# EasyEDA Pro project ProPrj_Dual_Motor_Driver_2026-05-02.epro, board PCB1
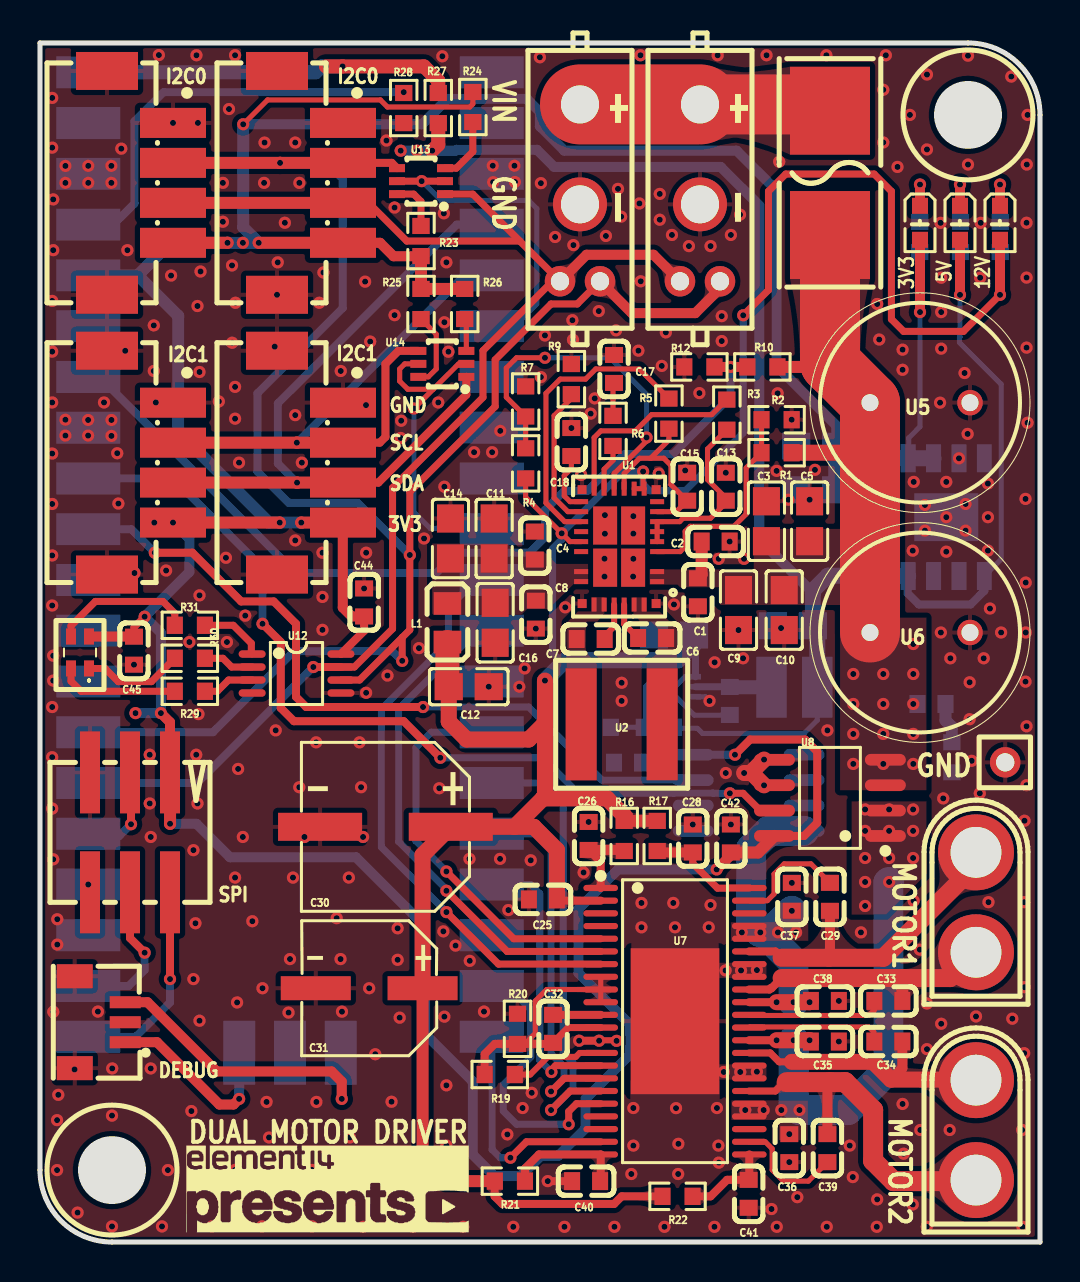
[diagram p3: board, top side]
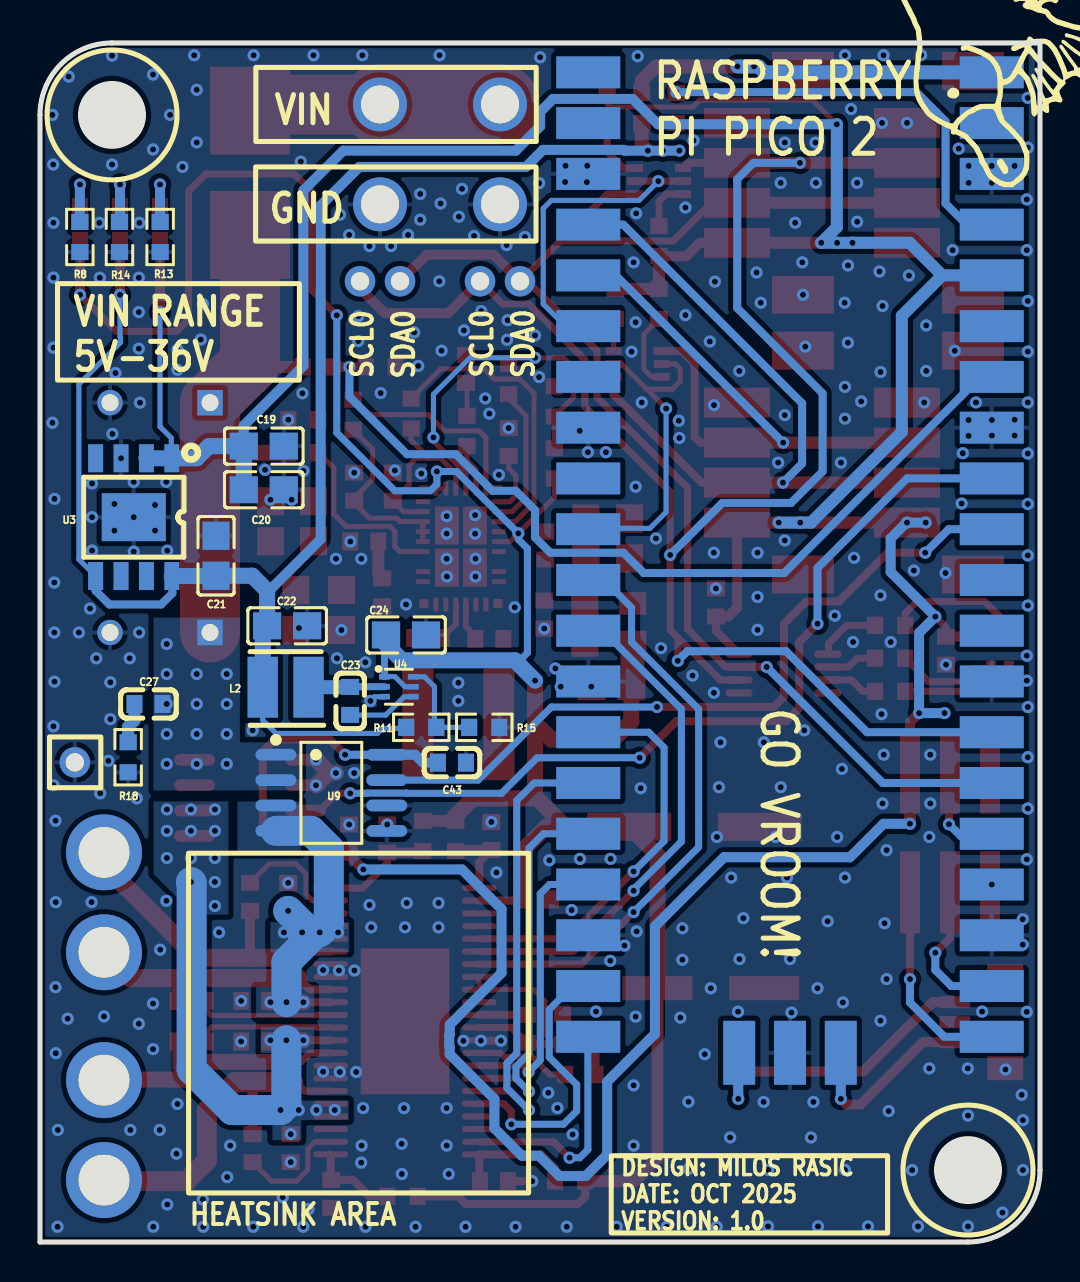
[diagram p4: board, bottom side, seen from below]

Outline 50 x 60 mm; copper layers: Top Layer, Inner1, Inner2, Bottom Layer. Coordinates in mm from the lower left corner of the outline.
Outline path: 0,60 46.4,60 arc(48.95,58.94) 50,56.4 50,0 3.6,0 arc(1.05,1.05) 0,3.6 0,60
Stack: Top Layer 0.035mm Outer layer thickness 1oz / Dielectric1 0.2104mm 7628 RC49% 8.6mil / Inner1 0.0152mm Inner layer thickness / Dielectric2 1.065mm 1.1mm H/HOZ Copper / Inner2 0.0152mm Inner layer thickness / Dielectric3 0.2104mm 7628 RC49% 8.6mil / Bottom Layer 0.035mm Outer layer thickness 1oz

## Design rules (mm)
template: Custom Config
spacing copperThickness1oz (default): track to track 0.102, other pairs 0.152 to 0.3
spacing copperThickness2oz: track to track 0.203, other pairs 0.152 to 0.3
track width copperThickness1oz (default): min 0.127, default 0.254, max 5
track width copperThickness2oz: min 0.203, default 0.254, max 5
differential pair differentialPair (default): width min 0.127, default 0.254, max 2.54; gap min 0.152, default 0.152
via viaSize (default): diameter min 0.5, default 0.61, max 10; hole min 0.3, default 0.305, max 6.3

## Placement (name value [footprint] x y rotation side)
1PinHeader  -  [1PinHeader]  48.26 24 0 top
C1  100nF  [C0603]  32.89 32.51 270 top
C2  100nF  [C0603]  33.78 35.05 0 top
C3  10uF  [C0805]  36.32 36.07 90 top
C4  100nF  [C0603]  24.74 34.85 90 top
C5  10uF  [C0805]  38.48 36.07 270 top
C6  100nF  [C0603]  30.61 30.23 0 top
C7  100nF  [C0603]  27.53 30.17 180 top
C8  100nF  [C0603]  24.79 31.39 270 top
C9  10uF  [C0805]  34.93 31.62 90 top
C10  10uF  [C0805]  37.21 31.62 90 top
C11  22uF  [C0805]  22.71 35.2 90 top
C12  22uF  [C0805]  21.44 27.79 0 top
C13  4.7uF  [C0603]  34.29 37.8 90 top
C14  22uF  [C0805]  20.52 35.2 90 top
C15  470nF  [C0603]  32.36 37.8 90 top
C16  22uF  [C0805]  22.76 30.99 270 top
C17  22nF  [C0603]  28.7 43.69 90 top
C18  100nF  [C0603]  26.57 40.03 270 top
C19  22uF  [C0805]  38.81 39.83 0 bottom
C20  22uF  [C0805]  38.81 37.64 0 bottom
C21  22uF  [C0805]  41.2 34.34 270 bottom
C22  22uF  [C0805]  37.64 30.84 0 bottom
C23  100nF  [C0603]  34.49 27.08 270 bottom
C24  22uF  [C0805]  31.7 30.38 0 bottom
C25  1uF  [C0603]  25.15 17.14 0 top
C26  1uF  [C0603]  27.43 20.32 270 top
C27  10nF  [C0603]  44.58 26.92 0 bottom
C28  1uF  [C0603]  32.64 20.19 270 top
C29  1uF  [C0603]  39.5 17.27 270 top
C30  330uF  [CAP-SMD_BD8.0-L8.3-W8.3-FD]  17.27 20.78 180 top
C31  47uF  [CAP-SMD_BD6.3-L6.6-W6.6-LS7.8-FD]  16.46 12.7 180 top
C32  100nF  [C0603]  25.65 10.67 90 top
C33  1uF  [C0603]  42.42 12.06 0 top
C34  1uF  [C0603]  42.42 10.03 0 top
C35  100nF  [C0603]  39.24 10.03 180 top
C36  100nF  [C0603]  37.47 4.7 90 top
C37  100nF  [C0603]  37.59 17.27 270 top
C38  100nF  [C0603]  39.24 12.06 180 top
C39  1uF  [C0603]  39.37 4.7 90 top
C40  1uF  [C0603]  27.31 3.05 180 top
C41  1uF  [C0603]  35.43 2.41 270 top
C42  100nF  [C0603]  34.54 20.19 90 top
C43  100nF  [C0603]  29.4 23.99 180 bottom
C44  100nF  [C0603]  16.21 32 270 top
C45  100nF  [C0603]  4.7 29.59 90 top
CN1  XT30U-M  [CONN-TH_XT30U-M]  46.8 17 90 top
CN2  XT30U-M  [CONN-TH_XT30U-M]  46.8 5.6 90 top
CN3  WAFER-PH2.0-4PLB  [CONN-SMD_4P-P2.00_WAFER-200L-4A]  13.5 53 270 top
CN4  WAFER-PH2.0-4PLB  [CONN-SMD_4P-P2.00_WAFER-200L-4A]  5 53 270 top
CN5  WAFER-PH2.0-4PLB  [CONN-SMD_4P-P2.00_WAFER-200L-4A]  5 39 270 top
CN6  WAFER-PH2.0-4PLB  [CONN-SMD_4P-P2.00_WAFER-200L-4A]  13.5 39 270 top
CN7  98424-G52-06ALF  [CONN-SMD_98424-G52-06ALF]  4.5 20.5 180 top
F1  0154001.DR  [FUSE-SMD_L9.8-W5.1]  39.5 53.5 270 top
L1  MPZ2012S221ATD25  [L0805]  20.37 30.99 270 top
L2  ME3220-472MLC  [IND-SMD_L3.2-W2.8]  37.72 27.76 180 bottom
LED1  -  [LED0603-R-RD]  48 51 270 top
LED2  -  [LED0603-R-RD]  44 51 270 top
LED3  -  [LED0603-R-RD]  46 51 270 top
LED4  -  [150066M153000]  2 29.5 90 top
MH1  M3 Screw  [MOUNTINGHOLE-M3]  46.4 56.4 0 top
MH2  M3 Screw  [MOUNTINGHOLE-M3]  3.6 3.6 0 top
PowerConnector1  XT30(2+2)PB-M.G.B  [CONN-TH_XT30PB-M]  27 52.5 270 top
PowerConnector2  XT30(2+2)PB-M.G.B  [CONN-TH_XT30PB-M]  33 52.5 270 top
R1  120k  [R0603]  36.83 39.5 0 top
R2  100k  [R0603]  36.83 41.15 180 top
R3  100k  [R0603]  34.34 41.4 270 top
R4  110k  [R0603]  24.28 38.96 270 top
R5  100k  [R0603]  31.44 41.45 90 top
R6  5.1k  [R0603]  28.65 40.59 270 top
R7  10K  [R0603]  24.28 42.06 270 top
R8  4.7k  [R0603]  48.01 50.29 90 bottom
R9  143k  [R0603]  26.57 43.18 270 top
R10  100k  [R0603]  36.12 43.79 0 top
R11  53k  [R0603]  30.94 25.76 0 bottom
R12  10K  [R0603]  32.97 43.79 0 top
R13  1k  [R0603]  43.99 50.29 90 bottom
R14  2k  [R0603]  46.03 50.29 90 bottom
R15  10K  [R0603]  27.79 25.76 0 bottom
R16  5R  [R0603]  29.21 20.32 270 top
R17  5R  [R0603]  30.86 20.32 90 top
R18  3R3  [R0603]  45.59 24.26 90 bottom
R19  24K  [R0603]  22.99 8.38 0 top
R20  1R  [R0603]  23.88 10.67 270 top
R21  5R  [R0603]  23.5 3.05 0 top
R22  5R  [R0603]  31.88 2.29 0 top
R23  4k7  [R0603]  19.05 50.09 270 top
R24  4k7  [R0603]  21.64 56.79 90 top
R25  4k7  [R0603]  19.05 46.94 90 top
R26  4k7  [R0603]  21.23 46.94 90 top
R27  0R  [R0603]  19.91 56.74 270 top
R28  0R  [R0603]  18.19 56.74 270 top
R29  1kΩ  [R0603]  7.49 27.56 0 top
R30  1kΩ  [R0603]  7.49 29.21 0 top
R31  1kΩ  [R0603]  7.49 30.86 0 top
TP_3V1  -  [Test-Point-0.5mm]  44 48.5 0 top
TP_5V  -  [Test-Point-0.5mm]  46 48.5 0 top
TP_12V  -  [Test-Point-0.5mm]  48 48.5 0 top
U1  LT8350RV#PBF  [LQFN-32_L6.0-W4.0-P0.50-BL-EP_LT8350RV]  28.96 34.8 90 top
U2  6.8uH  [IND-SMD_L6.6-W6.4]  29.08 25.91 0 top
U3  BD33HC0VEFJ-ME2  [HTSOP-J8_L4.9-W3.9-P1.27-LS6.0-BL-EP]  45.31 36.27 0 bottom
U4  AP62200Z6-7  [SOT-563_L1.6-W1.2-P0.50-LS1.6-BL]  32.06 27.79 270 bottom
U5  ECA1HM471B  [CAPPRD500W65D1000H2200]  41.5 42 0 top
U6  ECA1HM471B  [CAPPRD500W65D1000H2200]  41.5 30.5 0 top
U7  DRV8412DDWR  [HTSSOP-44_L14.0-W6.1-P0.64-LS8.1-BL-EP]  31.75 11.05 270 top
U8  ACS722LLCTR-10AB-T  [SOIC-8_L4.9-W3.9-P1.27-LS6.0-BL]  39.5 22.22 90 top
U9  ACS722LLCTR-10AB-T  [SOIC-8_L4.9-W3.9-P1.27-LS6.0-BL]  35.43 22.48 270 bottom
U10  BM03B-SRSS-TB(LF)(SN)  [CONN-SMD-3P-P1.00_BM03B-SRSS-TB-LF-SN]  3 11 270 top
U11  PICO  [COMM-SMD_L51.0-W21.0-P2.54_SC0916]  12.5 34 270 bottom
U12  PCA9633DP1,118  [TSSOP-8_L3.0-W3.0-P0.65-LS4.9-BL]  12.83 28.45 270 top
U13  RN2905,LF(CT  [SOT-323-6_L2.0-W1.3-P0.65-LS2.1-BR]  19.05 53.09 0 top
U14  RN2905,LF(CT  [SOT-323-6_L2.0-W1.3-P0.65-LS2.1-BR]  20.12 43.94 0 top

## Footprints (pads in the part's own frame, mm; a bottom-side part is the same pattern mirrored in y, then rotated)
1PinHeader
  round 1.524 hole 0.914: 1(0,0)
150066M153000
  rect 0.8x0.5 smd: 1(-0.8,-0.45) 2(-0.8,0.45) 3(0.8,0.45) 4(0.8,-0.45)
C0603
  rect 0.8x0.9 smd: 1(-0.7,0) 2(0.7,0)
C0805
  rect 1.41x1.35 smd: 1(-1,0) 2(1,0)
CAP-SMD_BD6.3-L6.6-W6.6-LS7.8-FD
  rect 3.5x1.2 smd: 1(-2.67,0) 2(2.67,0)
CAP-SMD_BD8.0-L8.3-W8.3-FD
  rect 4.2x1.4 smd: 1(-3.267,0) 2(3.267,0)
CAPPRD500W65D1000H2200
  rect 1.275x1.275 hole 0.85: 1(0,0)
  round 1.275 hole 0.85: 2(5,0)
COMM-SMD_L51.0-W21.0-P2.54_SC0916
  rect 1.6x3.2 smd: 1(-24.53,-10.088) 2(-21.99,-10.088) 3(-19.45,-10.088) 4(-16.91,-10.088) 5(-14.37,-10.088) 6(-11.83,-10.088) 7(-9.29,-10.088) 8(-6.75,-10.088) 9(-4.21,-10.088) 10(-1.67,-10.088) 11(0.87,-10.088) 12(3.41,-10.088) 13(5.95,-10.088) 14(8.49,-10.088) 15(11.03,-10.088) 16(13.57,-10.088) 17(16.11,-10.088) 18(18.65,-10.088) 19(21.19,-10.088) 20(23.73,-10.088) 21(23.73,10.088) 22(21.19,10.088) 23(18.65,10.088) 24(16.11,10.088) 25(13.57,10.088) 26(11.03,10.088) 27(8.49,10.088) 28(5.95,10.088) 29(3.41,10.088) 30(0.87,10.088) 31(-1.67,10.088) 32(-4.21,10.088) 33(-6.75,10.088) 34(-9.29,10.088) 35(-11.83,10.088) 36(-14.37,10.088) 37(-16.91,10.088) 38(-19.45,10.088) 39(-21.99,10.088) 40(-24.53,10.088)
  rect 3.2x1.6 smd: 41(24.53,-2.54) 42(24.53,0) 43(24.53,2.54)
CONN-SMD-3P-P1.00_BM03B-SRSS-TB-LF-SN
  rect 0.6x1.55 smd: 1(1,1.262) 2(0,1.262) 3(-1,1.262)
  rect 1.2x1.8 smd: 4(2.3,-1.262) 5(-2.3,-1.262)
CONN-SMD_4P-P2.00_WAFER-200L-4A
  rect 1.5x3.3 smd: 1(-3,1.65) 2(-1,1.65) 3(1,1.65) 4(3,1.65)
  rect 1.9x3.1 smd: 5(5.6,-1.65) 6(-5.6,-1.65)
CONN-SMD_98424-G52-06ALF
  rect 1x4.1 smd: 1(-2,-3) 2(-2,3) 3(0,-3) 4(0,3) 5(2,-3) 6(2,3)
CONN-TH_XT30PB-M
  round 1.524 hole 0.914: 1(4.425,1) 2(4.425,-1)
  round 2.7 hole 1.9: 3(0.575,0) 4(-4.425,0)
CONN-TH_XT30U-M
  round 3.8 hole 2.54: 1(-2.5,0) 2(2.5,0)
FUSE-SMD_L9.8-W5.1
  rect 4.4x4 smd: 1(-3.11,0) 2(3.11,0)
HTSOP-J8_L4.9-W3.9-P1.27-LS6.0-BL-EP
  rect 0.75x1.399 smd: 1(-1.905,-2.946) 2(-0.635,-2.946) 3(0.635,-2.946) 4(1.905,-2.946) 5(1.905,2.946) 6(0.635,2.946) 7(-0.635,2.946) 8(-1.905,2.946)
  rect 3.2x2.4 smd: 9(0,0)
HTSSOP-44_L14.0-W6.1-P0.64-LS8.1-BL-EP
  oval 0.308x1.729 smd: 1(-6.668,-3.715) 2(-6.032,-3.715) 3(-5.397,-3.715) 4(-4.763,-3.715) 5(-4.128,-3.715) 6(-3.493,-3.715) 7(-2.857,-3.715) 8(-2.223,-3.715) 9(-1.587,-3.715) 10(-0.953,-3.715) 11(-0.318,-3.715) 12(0.318,-3.715) 13(0.953,-3.715) 14(1.587,-3.715) 15(2.223,-3.715) 16(2.857,-3.715) 17(3.493,-3.715) 18(4.128,-3.715) 19(4.763,-3.715) 20(5.397,-3.715) 21(6.032,-3.715) 22(6.668,-3.715) 23(6.668,3.715) 24(6.032,3.715) 25(5.397,3.715) 26(4.763,3.715) 27(4.128,3.715) 28(3.493,3.715) 29(2.857,3.715) 30(2.223,3.715) 31(1.587,3.715) 32(0.953,3.715) 33(0.318,3.715) 34(-0.318,3.715) 35(-0.953,3.715) 36(-1.587,3.715) 37(-2.223,3.715) 38(-2.857,3.715) 39(-3.493,3.715) 40(-4.128,3.715) 41(-4.763,3.715) 42(-5.397,3.715) 43(-6.032,3.715) 44(-6.668,3.715)
  rect 7.3x4.43 smd: 45(0,0)
IND-SMD_L3.2-W2.8
  rect 1.52x3.05 smd: 1(-1.145,0) 2(1.145,0)
IND-SMD_L6.6-W6.4
  rect 1.55x5.6 smd: 1(-2.025,0) 2(2.025,0)
L0805
  rect 1.133x1.377 smd: 1(-0.966,0) 2(0.966,0)
LED0603-R-RD
  rect 0.8x0.8 smd: 1(0.851,0) 2(-0.851,0)
LQFN-32_L6.0-W4.0-P0.50-BL-EP_LT8350RV
  rect 0.25x0.7 smd: 2(-1.75,-1.9) 3(-1.25,-1.9) 5(-0.25,-1.9) 6(0.25,-1.9) 7(0.75,-1.9) 8(1.25,-1.9) 9(1.75,-1.9) 10(2.25,-1.9) 17(2.25,1.9) 18(1.75,1.9) 19(1.25,1.9) 20(0.75,1.9) 21(0.25,1.9) 22(-0.25,1.9) 24(-1.25,1.9) 25(-1.75,1.9)
  rect 0.7x0.25 smd: 11(2.9,-1.25) 12(2.9,-0.75) 13(2.9,-0.25) 14(2.9,0.25) 15(2.9,0.75) 16(2.9,1.25) 27(-2.9,1.25) 28(-2.9,0.75) 29(-2.9,0.25) 30(-2.9,-0.25) 31(-2.9,-0.75) 32(-2.9,-1.25)
  rect 1.91x1.2 smd: 33(-1.055,-0.7) 34(-1.055,0.7) 35(1.055,-0.7) 36(1.055,0.7)
  rect 0.45x0.45 smd: 37(-2.85,1.85) 37(-2.85,-1.85) 37(2.85,1.85) 37(2.85,-1.85)
R0603
  rect 0.806x0.864 smd: 1(-0.753,0) 2(0.753,0)
SOIC-8_L4.9-W3.9-P1.27-LS6.0-BL
  oval 0.588x2.045 smd: 1(-1.905,-2.772) 2(-0.635,-2.772) 3(0.635,-2.772) 4(1.905,-2.772) 5(1.905,2.772) 6(0.635,2.772) 7(-0.635,2.772) 8(-1.905,2.772)
SOT-323-6_L2.0-W1.3-P0.65-LS2.1-BR
  rect 0.8x0.4 smd: 1(1.2,-0.65) 2(1.2,0) 3(1.2,0.65) 4(-1.2,0.65) 5(-1.2,0) 6(-1.2,-0.65)
SOT-563_L1.6-W1.2-P0.50-LS1.6-BL
  rect 0.28x0.545 smd: 1(-0.5,-0.723) 2(0,-0.723) 3(0.5,-0.723) 4(0.5,0.723) 5(0,0.723) 6(-0.5,0.723)
Test-Point-0.5mm
  round 0.5 smd: 1(0,0)
TSSOP-8_L3.0-W3.0-P0.65-LS4.9-BL
  oval 0.37x1.35 smd: 1(-0.975,-2.22) 2(-0.325,-2.22) 3(0.325,-2.22) 4(0.975,-2.22) 5(0.975,2.22) 6(0.325,2.22) 7(-0.325,2.22) 8(-0.975,2.22)

## Nets
As in the schematic.

Pads without a net: U1 10 20 22; U3 4 6 7; U7 3 4 19 20 25 42; U11 1 2 7 9 29 30 35 39; U12 4

## Via types
v1: diameter 0.61, hole 0.305, Top Layer to Bottom Layer, 491 vias

## Routing (per net, layer and track width the routed paths; a pad name or vN(x,y) marks a point on that pad's centre or on a via; arc(x,y) is an arc through that point)
3V3: length 233.8
  Top Layer w0.254: v1(10.16,55.93) 11.38,57.15 17.02,57.15 17.37,56.79 21.49,56.79 21.64,56.95 R24.2
  Top Layer w0.35: C45.2 4.7,30.76 v1(5.23,31.29)
  Top Layer w0.4: v1(34.75,24.38) 35.51,25.15 38.25,25.15 38.86,24.54 38.86,20.98 38.2,20.32 U8.8 ; 15.05,29.42 16.21,30.58 C44.2
  Top Layer w0.5: CN7.1 6.5,26.01 v1(6.05,26.47) ; C42.1 34.54,19.36 v1(33.83,18.64) ; CN3.4 17,50 17.68,49.33 19.04,49.33 R23.2 ; LED4.4 4.69,30.3 C45.2 ; C44.2 15.58,31.3 15.14,31.75 15.14,35.99 CN6.4 ; v1(44,46.53) TP_3V1.1 LED2.1
  Top Layer w0.6: v1(6.65,36) v1(11.99,36) ; R26.2 R25.2 19.05,49.32 19.04,49.33 ; v1(10.94,50) CN3.4 ; U8.8 35.9,19.49 C42.1 ; CN4.4 v1(9.38,50) ; v1(6.5,20.93) 6.5,23.5 CN7.1 ; v1(13.06,36) CN6.4
  Bottom Layer w0.254: 43.43,39.37 43.43,40.23 44,40.8 v1(44,46.53)
  Bottom Layer w0.4: U9.8 v1(34.75,24.38)
  Bottom Layer w0.5: U9.8 31.24,24.38 30.85,23.99 C43.1 ; v1(6.5,20.93) 7.82,20.93 9.5,19.25 15.8,19.25 19.25,15.8 19.25,10.41 21.64,8.03 21.64,4.37 22.71,3.3 24.03,3.3 25.04,4.32 25.91,4.32 27.28,5.69 27.28,7.16 29.51,9.4 29.51,9.75 29.54,9.77 29.54,10.36 29.51,10.38 29.51,10.87 26.92,13.46 26.92,16.66 28.91,18.64 v1(33.83,18.64) ; v1(5.72,36) v1(6.65,36) 6.67,36 7.47,35.2 7.47,33.53 v1(5.23,31.29) 6.05,30.48 v1(6.05,26.47) v1(4.78,26.47) ; C19.2 39.81,40.86 36.83,43.84 36.83,52.62 34.84,54.61 26.21,54.61 24.99,55.83 24.99,56.55 24.34,57.2 20.37,57.2 19.1,55.93 v1(10.16,55.93)
  Bottom Layer w0.6: 4.89,48.37 6.52,50 v1(9.38,50) v1(10.14,50) v1(10.94,50) 10.16,50.78 v1(10.16,55.93) ; 4.89,48.37 6.91,46.35 6.91,40.54 11.45,36 v1(11.99,36) v1(13.06,36) ; 4.89,48.37 U11.36
  Bottom Layer w0.8: U3.2 U3.1 42.16,39.22 41.55,39.83 C19.2 C20.2
5V: length 84.1
  Top Layer w0.5: v1(46,47.4) TP_5V.1 LED3.1
  Top Layer w0.7: R27.2 19.91,54.92 v1(19.61,54.61)
  Bottom Layer w0.254: v1(46,47.4) 46,45.29 45.97,45.26 45.97,45.01 48.06,42.93 48.06,34.16 U3.5 ; L2.1 38.86,26.11 38.2,25.45 33.12,25.45 32.87,25.7 31.74,25.7 R11.2
  Bottom Layer w0.4: U3.5 47.22,32.59 46.53,31.9 43.94,31.9 43.38,32.46 43.38,33.07
  Bottom Layer w0.5: v1(18.03,54.61) v1(18.85,54.61) v1(19.61,54.61) 20.78,54.61 20.82,54.65 24.85,54.65 25.71,53.8 34.04,53.8 35.97,51.87 35.97,35.17 38.64,32.49
  Bottom Layer w0.8: U3.8 41.22,33.33 C21.2 39.39,33.34 38.64,32.6 C22.2 38.86,30.61 L2.1
12V: length 137.8
  Top Layer w0.254: U1.12 U1.11 30.16,37.75 v1(30.16,38.56) ; U1.21 26.5,35.05 v1(26.08,35.46) 24.28,37.27 R4.2
  Top Layer w0.35: v1(35.16,46.37) 36.42,47.64 36.42,52.58 37.29,53.44 41.71,53.44 42.57,52.58 42.57,46.18 43.18,45.57 46.17,45.57 v1(48,47.4)
  Top Layer w0.4: U7.2 25.91,17.08 C25.2 ; R22.1 29.08,2.29 28.7,1.91 23.11,1.91 22.73,2.29 22.73,3.04 R21.1
  Top Layer w0.5: LED1.1 TP_12V.1 v1(48,47.4)
  Top Layer w0.6: R21.1 20.27,3.05 19.13,4.19 C31.1 ; R16.1 R17.2
  Top Layer w0.8: C25.2 25.85,19.62 24.69,20.78 23.72,20.78 ; 25.15,22.2 23.72,20.78 ; 25.15,22.2 28.35,22.2 29.21,21.34 R16.1 ; 25.15,22.2 25.25,22.3 25.25,25.96 ; 23.72,20.78 C30.1 19.13,19.37 C31.1 ; C12.1 20.44,26.04 21.34,25.15 24.44,25.15 25.25,25.96 ; 25.25,25.96 v1(25.25,28.09)
  Top Layer w1.2: L1.2 20.37,27.85 C12.1
  Bottom Layer w0.254: U4.1 32.77,28.3 32.26,28.3 31.75,27.79 U4.5
  Bottom Layer w0.35: 26.08,28.93 26.08,29.03 25.63,29.48 25.63,34.7 26.08,35.16 v1(26.08,35.46) 29.18,38.56 v1(30.16,38.56) 30.16,37.92 30.48,37.59 32.26,37.59 35.16,40.49 v1(35.16,46.37) ; U4.1 32.78,30.3 C24.2
  Bottom Layer w0.8: C24.2 32.7,29.91 31.9,29.11 26.26,29.11 26.08,28.93 v1(25.25,28.09)
GND: length 5.2
  Top Layer w0.4: v1(25.39,3.05) 26.6,3.05 ; v1(27.96,10.07) v1(26.96,10.07)
  Top Layer w0.8: v1(36.2,22.85) 35.59,23.47 35.53,23.47 ; 35.53,23.47 v1(36.2,24.14) ; 35.53,23.47 v1(35.2,23.47)
  Bottom Layer w0.254: v1(33.48,27.08) 33.27,27.29 U4.3
  vias: v1(0.61,57.25) v1(0.61,54.76) v1(0.61,47.09) v1(0.61,44.55) v1(0.61,42.01) v1(0.61,39.46) v1(0.61,36.93) v1(0.61,34.36) v1(0.61,31.85) v1(0.61,26.77) v1(0.61,24.26) v1(0.61,21.69) v1(0.66,52.17) v1(0.66,49.63) v1(0.66,29.34) v1(0.66,28.09) v1(0.66,19.15) v1(0.66,11.52) v1(0.86,16.15) v1(0.86,14.88) v1(0.91,7.37) v1(0.85,6.1) v1(0.85,3.6) v1(1.27,53.85) v1(1.27,53) v1(1.27,41.15) v1(1.27,40.35) v1(1.73,8.64) v1(1.88,1.47) v1(2.41,53.85) v1(2.41,53) v1(2.41,41.14) v1(2.41,40.35) v1(2.9,11.53) v1(3.2,42.01) v1(3.57,53.85) v1(3.57,53) v1(3.57,41.14) v1(3.57,40.34) v1(3.61,8.69) v1(3.6,6.33) v1(3.6,0.78) v1(3.86,39.47) v1(3.92,36.95) v1(4.06,54.71) v1(4.26,44.6) v1(4.37,49.63) v1(4.72,33.48) v1(4.7,28.89) v1(5.49,24.38) v1(5.49,21.95) v1(5.54,20.27) v1(5.54,8.69) v1(5.69,45.87) v1(5.69,43.59) v1(5.79,42.01) v1(5.94,59.39) v1(6.1,0.78) v1(6.31,33.6) v1(6.39,3.6) v1(6.55,48.36) v1(6.65,56) v1(7.47,30.02) v1(7.57,6.55) v1(7.67,19.61) v1(7.67,13.16) v1(7.82,59.39) v1(7.81,24.38) v1(7.77,15.95) v1(7.9,56) v1(7.87,46.84) v1(7.92,26.42) v1(7.87,21.95) v1(8.03,48.56) v1(7.98,43.54) v1(7.98,32.36) v1(7.98,11.07) v1(8.6,0.78) v1(8.94,42.06) v1(9.14,53) v1(9.14,51.05) v1(9.3,34.24) v1(9.35,30.02) v1(9.45,56.69) v1(9.6,48.87) v1(9.61,45) v1(9.75,59.39) v1(9.77,47) v1(9.75,42.79) v1(9.75,41.2) v1(9.75,18.24) v1(9.75,3.61) v1(9.91,23.67) v1(9.85,11.99) v1(9.95,39) v1(10.14,20.27) v1(10.26,31.34) v1(10.62,16.05) v1(11.12,12.7) v1(11.1,0.78) v1(11.23,55.02) v1(11.2,53) v1(11.33,7.01) v1(11.45,5.23) v1(11.74,44.81) v1(11.85,47.4) v1(11.79,25.6) v1(11.89,49.02) v1(12.24,51) v1(12.43,11.48) v1(12.5,14.16) v1(12.65,18.24) v1(12.76,55.02) v1(12.76,41.38) v1(12.76,35.11) v1(12.97,53) v1(12.96,22.76) v1(13.09,39) v1(13.22,20.27) v1(13.59,3.61) v1(13.6,0.78) v1(13.81,25) v1(13.82,7.01) v1(13.97,47) v1(14.12,34.49) v1(14.12,32.28) v1(14.12,30.63) v1(14.17,48.51) v1(14.83,16.2) v1(15.04,43.59) v1(15.03,14.16) v1(15.1,11.53) v1(15.44,18.24) v1(15.49,5.23) v1(15.98,25) v1(16.05,22.76) v1(16.21,32.7) v1(16.15,20.27) v1(16.16,0.76) v1(16.26,48.06) v1(16.3,41.88) v1(16.31,34.49) v1(16.31,27.48) v1(16.51,45.06) v1(16.46,12.7) v1(16.76,9.4) v1(17.32,55.12) v1(17.37,28.35) v1(17.58,7.02) v1(17.58,3.66) v1(17.73,51.77) v1(17.73,46.38) v1(17.88,15.7) v1(17.88,14.12) v1(18.03,40.23) v1(17.98,11.23) v1(18.06,41.1) v1(18.66,0.76) v1(18.95,29.72) v1(19.2,35.2) v1(19.91,42.01) v1(19.96,22.71) v1(20.12,59.33) v1(20.19,51.47) v1(20.22,46.03) v1(20.22,37.8) v1(20.17,15.55) v1(20.22,11.28) v1(20.32,49.02) v1(20.32,7.84) v1(20.32,4.83) v1(20.42,44.55) v1(20.78,14.83) v1(21.16,0.76) v1(21.47,19.17) v1(21.49,14.07) v1(21.7,39.52) v1(22.2,11.53) v1(22.44,27.79) v1(22.64,53.86) v1(22.61,39.52) v1(22.66,53.03) v1(23.01,40.59) v1(23,19.17) v1(23.42,16.61) v1(23.37,5.38) v1(23.72,53.86) v1(23.75,53.04) v1(23.66,0.76) v1(23.96,27.79) v1(24.13,6.71) v1(24.23,28.7) v1(24.54,19.1) v1(24.59,7.47) v1(24.79,30.69) v1(24.99,59.28) v1(25.04,52.98) v1(25.04,43.28) v1(25.25,45.36) v1(25.76,50.29) v1(26.22,0.76) v1(26.26,31.76) v1(26.62,46.13) v1(26.57,40.73) v1(26.67,49.89) v1(26.65,45.14) v1(27.06,38.39) v1(27.18,18.49) v1(27.43,21.02) v1(27.53,41.45) v1(27.74,42.22) v1(27.94,46.58) v1(28.25,36.37) v1(28.25,35.44) v1(28.23,34.19) v1(28.23,33.3) v1(28.3,50.34) v1(28.72,0.76) v1(28.8,45.62) v1(28.83,10.07) v1(28.9,52.7) v1(29.06,51.31) v1(29.08,27.98) v1(29.08,27.08) v1(29.57,3.4) v1(29.67,36.32) v1(29.67,35.45) v1(29.67,34.19) v1(29.66,33.3) v1(29.67,6.71) v1(29.67,4.83) v1(29.92,44.6) v1(30.02,59.39) v1(29.97,51.97) v1(30.04,48.08) v1(30.07,16.97) v1(30.07,15.75) v1(30.94,38.46) v1(30.99,52.45) v1(30.99,51.16) v1(31.09,43.84) v1(31.22,0.76) v1(31.29,45.52) v1(31.6,50.39) v1(31.7,31.9) v1(31.66,16.97) v1(31.75,15.75) v1(31.8,6.7) v1(31.92,4.91) v1(31.91,3.4) v1(32.26,38.61) v1(32.45,49.83) v1(32.64,20.89) v1(32.97,42.48) v1(33.44,15.75) v1(33.53,49.83) v1(33.53,16.87) v1(33.73,29.01) v1(33.72,0.76) v1(33.85,6.71) v1(33.88,59.39) v1(33.93,34.19) v1(33.92,4.83) v1(33.94,3.97) v1(34.09,46.33) v1(34.09,45.08) v1(34.19,8.51) v1(34.29,38.5) v1(34.29,23.47) v1(34.28,13.59) v1(34.54,50.39) v1(34.48,35.05) v1(34.54,20.89) v1(34.93,30.62) v1(35,51.41) v1(35.01,8.51) v1(35.05,13.59) v1(35.2,34.19) v1(35.15,29.21) v1(35.85,13.61) v1(35.85,8.52) v1(36.33,59.39) v1(36.58,1.65) v1(36.83,38.59) v1(36.84,0.76) v1(36.88,42.47) v1(36.96,54.06) v1(37.05,30.72) v1(37.42,37.15) v1(37.47,4) v1(37.58,41.15) v1(37.59,17.97) v1(37.87,2.25) v1(38.48,37.15) v1(38.75,38.64) v1(39.32,59.39) v1(39.34,0.76) v1(39.37,25.6) v1(39.94,12.06) v1(39.94,10.03) v1(40.49,4.83) v1(40.64,3.25) v1(41.05,15.49) v1(41.84,0.76) v1(41.86,46.94) v1(41.86,2.13) v1(41.96,45.16) v1(42.16,57.66) v1(42.16,55.02) v1(42.29,59.39) v1(42.88,53.8) v1(43.13,44.65) v1(43.13,43.65) v1(43.13,6.91) v1(43.18,4.42) v1(43.5,56.4) v1(43.64,34.59) v1(43.64,1.88) v1(43.69,38.04) v1(43.68,17.08) v1(43.99,14.63) v1(44.02,5.61) v1(44.25,36.88) v1(44.25,35.6) v1(44.35,58.42) v1(44.35,54.67) v1(44.35,11.93) v1(44.35,9.65) v1(44.34,0.76) v1(45.03,51) v1(45,42) v1(45.04,30.5) v1(45.06,48.25) v1(45.06,46.53) v1(45.06,44.7) v1(45.06,10.92) v1(45.16,22.2) v1(45.31,38.04) v1(45.31,36.27) v1(45.31,34.54) v1(45.52,29.21) v1(45.48,5.61) v1(45.95,39.22) v1(46.23,43.48) v1(46.28,36.93) v1(46.28,35.6) v1(46.4,59.36) v1(46.4,53.92) v1(46.38,40.44) v1(46.48,28.01) v1(46.48,26.16) v1(46.58,24.08) v1(46.8,11.29) v1(47.03,51) v1(47.01,48.25) v1(46.99,22.45) v1(47.19,29.21) v1(47.4,37.95) v1(47.4,36.27) v1(47.4,34.6) v1(47.42,17.01) v1(47.5,31.7) v1(48.06,30.5) v1(48.56,58.32) v1(48.62,11.18) v1(49.11,5.61) v1(49.12,0.76) v1(49.22,21.08) v1(49.21,17.01) v1(49.22,12.75) v1(49.21,9.45) v1(49.34,53.92) v1(49.33,51) v1(49.33,48.26) v1(49.33,44.75) v1(49.28,37.19) v1(49.29,33) v1(49.29,30.5) v1(49.28,28.04) v1(49.33,25.81) v1(49.33,22.86) v1(49.38,56.4) v1(49.38,41)
VIN_ADC: length 43.8
  Top Layer w0.5: R10.1 v1(34.53,43.79) R12.2
  Bottom Layer w0.4: v1(34.53,43.79) 34.53,42.3 31.65,39.42 29.21,39.42 27.38,37.59 26.21,37.59 25.25,36.63 25.25,35.25 24.49,34.49 20.83,34.49 19.81,33.48 12.79,33.48 2.98,43.29 U11.34
ACS722_OUT1: length 37.6
  Top Layer w0.4: v1(5.74,34.49) 7.62,34.49 10.06,32.06 11.68,32.06 12.8,30.94 12.8,27.28 13.31,26.77 v1(19.15,26.77)
  Bottom Layer w0.35: v1(19.15,26.77) 24.44,26.77 28.09,23.11 U9.7
  Bottom Layer w0.4: U11.31 4.56,35.67 v1(5.74,34.49)
ACS722_OUT2: length 44.8
  Top Layer w0.35: v1(34.49,22.45) 35.15,22.45 36.02,21.59 U8.7
  Top Layer w0.4: v1(20.01,24.23) 18.19,26.06 12.7,26.06 12.04,26.72 12.04,30.02 v1(11.12,30.94)
  Bottom Layer w0.35: v1(20.01,24.23) 25.15,24.23 26.92,22.45 31.66,22.45 31.68,22.47 33.65,22.47 33.66,22.45 v1(34.49,22.45)
  Bottom Layer w0.4: U11.32 6.65,38.21 11.12,33.73 v1(11.12,30.94)
DRIVER_FAULT: length 14
  Top Layer w0.35: v1(26.44,5.89) 26.44,6.53 26.82,6.92 U7.18
  Bottom Layer w0.35: U11.19 23.36,12.81 24.54,11.63 24.54,9.25 23.16,7.87 23.16,6.55 23.82,5.89 v1(26.44,5.89)
DRIVER_OTW: length 11.6
  Top Layer w0.35: v1(23.52,4.22) 24.32,5.02 U7.21
  Bottom Layer w0.35: v1(23.52,4.22) 23.01,4.22 22.61,4.62 22.61,10.25 U11.20
DRIVER_PWM_A: length 23
  Top Layer w0.35: U7.17 26.5,7.56 v1(25.55,6.6)
  Bottom Layer w0.35: v1(25.55,6.6) 26.65,7.71 26.65,8.96 26.16,9.45 26.16,22.1 25.29,22.97 U11.15
DRIVER_PWM_B: length 14.4
  Top Layer w0.35: v1(25.57,8.51) 25.57,8.62 25.78,8.83 U7.15
  Bottom Layer w0.35: U11.17 24.53,17.89 24.99,17.43 24.99,9.09 v1(25.57,8.51)
DRIVER_PWM_C: length 29.5
  Top Layer w0.35: v1(20.32,16.51) 22.92,13.91 U7.7
  Bottom Layer w0.35: v1(20.32,16.51) 17.07,19.76 17.07,26.67 20.42,30.02 20.42,31.75 21.8,33.13 U11.11
DRIVER_PWM_D: length 20
  Top Layer w0.35: v1(20.32,18.54) 23.69,15.18 U7.5
  Bottom Layer w0.35: v1(20.32,18.54) 18.8,20.07 18.8,24.74 19.57,25.51 U11.14
DRIVER_RESET_AB: length 18.7
  Top Layer w0.35: v1(25.55,7.53) 26.21,8.19 U7.16
  Bottom Layer w0.35: v1(25.55,7.53) 26.2,8.18 26.2,8.77 25.55,9.42 25.55,19.71 24.83,20.43 U11.16
DRIVER_RESET_CD: length 25.3
  Top Layer w0.35: U7.6 23.36,14.54 v1(20.32,17.58)
  Bottom Layer w0.35: U11.12 21.85,30.59 17.93,26.67 17.93,20.04 20.32,17.65 v1(20.32,17.58)
FB: length 17.8
  Top Layer w0.254: U1.14 28.71,38.46 30.33,40.08 v1(30.33,40.26) ; v1(25.25,44.25) 23.82,44.25 23.32,43.74 23.32,42.27 R7.2 R4.1
  Bottom Layer w0.254: v1(25.25,44.25) 28.5,44.25 30.33,42.42 v1(30.33,40.26)
I2C0_PULLUP_EN: length 16.2
  Top Layer w0.35: U13.5 v1(19.08,53.09) U13.2
  Bottom Layer w0.254: v1(19.08,53.09) 20.05,52.12 24.44,52.12 24.84,51.71 24.84,46.94 23.73,45.83 U11.6
I2C1_PULLUP_EN: length 16.5
  Top Layer w0.254: 19.66,42.67 18.39,42.67 17.98,43.08 17.98,43.69 18.24,43.94 U14.5 ; 19.66,42.67 20.93,43.94 U14.2 ; 19.66,42.67 v1(18.69,41.71)
  Bottom Layer w0.254: U11.10 22.54,35.71 19.51,35.71 18.69,36.53 v1(18.69,41.71)
PICO_SCL0: length 93.5
  Top Layer w0.35: 18.11,30.25 v1(18.11,29.08) ; 18.11,30.25 18.49,30.63 v1(18.49,34.38) 18.49,37.54 22.76,41.81 22.76,44.14 25.55,46.94 26.86,46.94 PowerConnector1.1 ; 18.11,30.25 15.98,28.12 15.05,28.12
  Top Layer w0.4: CN3.2 17.59,54 U13.4
  Top Layer w0.5: PowerConnector2.1 34,47.72 32.77,46.48 29.59,46.48 PowerConnector1.1
  Top Layer w0.6: CN4.2 v1(12,54) CN3.2
  Bottom Layer w0.4: 11.99,54 14.33,54 15.14,53.19 15.14,46.74 10.87,42.47 10.87,38.56 12.45,36.98 15.89,36.98 v1(18.49,34.38) ; v1(18.11,29.08) 17.63,29.57 12.7,29.57 8.64,25.51 U11.27
PICO_SCL1: length 29.5
  Top Layer w0.4: U14.4 17.92,44.59 17.27,43.94 17.27,40.28 16.99,40 CN6.2
  Top Layer w0.6: CN6.2 v1(12.84,40) CN5.2
  Bottom Layer w0.4: U11.5 21.21,48.37 v1(12.84,40)
PICO_SDA0: length 72.3
  Top Layer w0.35: 23.99,50.09 PowerConnector1.2 25.62,48.08 22.15,44.6 22.15,42.27 17.63,37.74 17.63,30.68 15.72,28.77 U12.7 ; 23.99,50.09 21.64,52.44 U13.1 ; 23.99,50.09 18.34,50.09 16.43,52 CN3.3
  Top Layer w0.4: U12.7 v1(13.66,28.77)
  Top Layer w0.5: PowerConnector2.2 30.67,49.4 27.33,49.4 PowerConnector1.2
  Top Layer w0.6: CN4.3 CN3.3
  Bottom Layer w0.4: U11.26 7.86,22.97 v1(13.66,28.77)
PICO_SDA1: length 36.1
  Top Layer w0.4: CN6.3 16.92,38 21.32,42.4 U14.1
  Top Layer w0.6: CN5.3 CN6.3
  Bottom Layer w0.4: v1(12.85,38) 11.89,38.96 11.89,41.97 20.84,50.91 U11.4
PICO_SPI_CS: length 7.3
  Top Layer w0.4: CN7.4 4.5,15.21 v1(5.23,14.48)
  Bottom Layer w0.4: U11.22 4.43,12.81 5.23,13.61 v1(5.23,14.48)
PICO_SPI_MISO: length 10.3
  Top Layer w0.4: CN7.2 v1(6.5,13.16)
  Bottom Layer w0.4: U11.21 4.78,10.27 6.5,11.99 v1(6.5,13.16)
PICO_SPI_MOSI: length 5
  Top Layer w0.4: CN7.3 4.55,23.45 v1(4.55,20.91)
  Bottom Layer w0.4: U11.25 2.52,20.32 3.96,20.32 v1(4.55,20.91)
PICO_SPI_SCK:
  vias: v1(2.41,17.89)
PWR: length 29.8
  Top Layer w0.6: C1.1 33.08,33.4 C2.1 ; R10.2 39.71,43.79
  Top Layer w0.8: R1.2 40.61,39.5 41.5,40.38
  Top Layer w3: U6.1 U5.1 39.5,44 F1.2
  vias: v1(40.66,28.42) v1(40.66,26.92) v1(40.66,25.42) v1(40.66,23.92) v1(42.16,28.42) v1(42.16,26.92) v1(42.16,25.42) v1(42.16,23.92) v1(43.66,29.92) v1(43.66,28.42) v1(43.66,26.92) v1(43.66,25.42) v1(43.66,23.92)
PWR_AB: length 21.4
  Top Layer w0.4: U7.32 v1(36.83,10.1)
  Top Layer w0.8: v1(36.83,10.1) v1(37.68,10.1) v1(38.48,10.1) C35.2
  Bottom Layer w1.5: v1(37.68,10.1) 37.68,6.89 v1(37.97,6.6) 40.39,6.6 42.42,8.64 42.42,17.98 v1(42.46,18.02)
  vias: v1(35.26,6.6) v1(36.18,6.6) v1(37.06,6.6) v1(37.47,5.4) v1(41.25,21.65) v1(41.25,20.57) v1(41.25,19.22) v1(41.25,18.02) v1(41.25,16.82) v1(42.46,21.65) v1(42.46,20.57) v1(42.46,19.22) v1(43.66,21.65) v1(43.66,20.57) v1(43.66,19.22)
PWR_CD: length 15.6
  Top Layer w0.4: U7.35 v1(36.83,12)
  Top Layer w0.8: v1(36.83,12) v1(37.68,12) v1(38.48,12) C38.2
  Bottom Layer w1.5: U9.4 36.45,20.57 35.56,19.69 35.56,15.95 v1(36.01,15.49) ; v1(36.9,15.49) 36.9,15.88 v1(37.59,16.57) ; v1(37.68,12) 37.68,14.01 36.45,15.24
  vias: v1(35.09,15.49) v1(37.8,15.49)
PWR_CONN: length 12.6
  Top Layer w3: PowerConnector2.4 39.19,56.92 F1.1
  Top Layer w4: PowerConnector1.4 PowerConnector2.4
SWCLK: length 15.7
  Top Layer w0.5: v1(15.09,7.16) 15.09,8.03 14.58,8.53 8.84,8.53 5.37,12 U10.3
  Bottom Layer w0.5: U11.41 15.09,9.42 v1(15.09,7.16)
SWDIO: length 9.4
  Top Layer w0.5: v1(9.96,7.16) 9.68,6.88 8.97,6.88 5.85,10 U10.1
  Bottom Layer w0.5: U11.43 9.96,7.17 v1(9.96,7.16)
VREF: length 9.3
  Top Layer w0.254: U1.9 31.81,36.55 C15.1 32.35,37.09 31.55,37.9 31.55,38.86 31.19,39.22 30.53,39.22 ; U1.13 29.21,38.45 29.97,39.22 30.53,39.22 ; 30.53,39.22 31.44,40.13 R5.1
$1N1363: length 4.7
  Top Layer w0.3: U7.14 26.98,9.46 26.79,9.27 25.4,9.27 24.51,8.38 R19.2
$1N1372: length 14.5
  Top Layer w0.254: U7.10 U7.9 ; U7.9 25.34,12.64 24.76,12.06 24.76,10.44 24.24,9.91 ; U7.9 U7.8
  Top Layer w0.35: C32.1 26.42,10.73 U7.12
  Top Layer w0.4: R19.1 22.23,9.41 22.74,9.91 R20.2 25.6,9.91 C32.1
$1N1456: length 2.4
  Top Layer w0.4: C32.2 28.03,11.37
$1N1664: length 4
  Top Layer w0.4: C26.2 28.04,19.02 U7.1
  Top Layer w0.5: C26.2 29.16,19.62 R16.2
$1N1857: length 6.1
  Top Layer w0.4: C40.1 28.04,3.08 U7.22 24.95,4.38 24.25,3.68 R21.2
$1N2033: length 4.4
  Top Layer w0.4: U7.23 35.46,3.14 C41.1 34.35,3.11 33.53,2.29 R22.2
$1N2177: length 5.7
  Top Layer w0.35: C28.2 32.64,18.94 33.88,17.71 34.37,17.71 34.38,17.72 U7.44
  Top Layer w0.5: R17.1 30.93,19.49 C28.2
$1N2316: length 5.7
  Top Layer w0.254: C39.1 38.42,3.05 37.17,3.05 36.61,3.61 36.61,4.67 36.26,5.02 U7.24
$1N2493: length 6.9
  Top Layer w0.254: 41.97,10.03 41.69,10.32 41.69,10.51 41.44,10.76 35.5,10.76 U7.33
$1N2538: length 6.8
  Top Layer w0.254: C33.1 41.72,11.62 41.44,11.34 35.5,11.34 U7.34
$1N2583: length 5.8
  Top Layer w0.254: U7.43 36.37,17.08 36.7,17.42 36.7,18.42 37.21,18.92 38.55,18.92 C29.1
$1N3603: length 2
  Bottom Layer w0.6: R18.2 45.59,25.78 45.28,26.1 C27.2
$1N5435: length 13.3
  Top Layer w0.4: 37.08,13.21 36.58,12.7 36.54,12.7 36.47,12.64 U7.36
  Top Layer w0.6: C33.2 43.12,13.15 43.17,13.21
  Top Layer w0.9: 37.08,13.21 45.51,13.21 CN1.1
$1N5444: length 16.4
  Top Layer w0.4: 37.08,14.22 36.77,14.54 U7.39
  Top Layer w0.5: C29.2 39.5,14.28 39.44,14.22
  Top Layer w0.9: CN1.2 46.8,18.86 42.16,14.22 37.08,14.22
$1N5477: length 13.8
  Top Layer w0.35: 37.34,9.02 36.96,9.02 36.51,9.46 U7.31
  Top Layer w0.5: C34.2 43.12,8.7 42.54,8.13
  Top Layer w0.8: 37.59,9.02 41.66,9.02 42.54,8.13 46.77,8.13 CN2.2
$1N5497: length 17.6
  Top Layer w0.35: 37.21,8 36.77,7.56 U7.28
  Top Layer w0.5: 39.5,8 39.37,7.87 C39.2
  Top Layer w1: 37.34,8 40.26,8 41.66,6.6 41.66,4.06 42.67,3.05 46.75,3.05 CN2.1
$2N434: length 9.3
  Top Layer w0.254: R3.2 33.38,39.68 33.38,38.15 34.29,37.24 C13.1 34.29,36.98 33.53,36.22 32.16,36.22 31.98,36.05 U1.8 U1.7 U1.6
$2N571: length 10.7
  Top Layer w0.254: R2.2 R1.1 36.07,39.5 35.31,38.73 35.31,36.42 34.7,35.81 32.51,35.81 32.26,35.56 32.26,34.8 32.01,34.55 U1.5
$2N1539: length 10
  Top Layer w0.254: U1.16 27.71,40.25 28.04,40.59 29.77,40.59 30.58,41.4 33.59,41.4 R3.1
$2N1741: length 14.9
  Top Layer w0.254: R5.2 29.96,43.69 27.79,43.69 27.28,43.18 26.01,43.18 25.3,42.47 25.3,36.98 26.23,36.05 U1.19
$2N2012: length 1.7
  Top Layer w0.254: C17.1 28.65,42.94 R6.1
$2N2016: length 2.3
  Top Layer w0.254: R6.2 28.65,39.12 28.21,38.67 U1.15
$2N2107: length 3.1
  Top Layer w0.254: U1.17 26.5,37.05 26.21,37.34 26.21,38.35 26.57,38.71 C18.2
$2N2141: length 7.2
  Top Layer w0.254: U1.18 26.39,36.55 25.71,37.24 25.71,41.35 26.57,42.22 R9.2
$2N2962: length 2
  Top Layer w0.3: U1.30 29.21,30.93 C6.1
$2N2981: length 1.9
  Top Layer w0.3: 28.13,30.23 28.71,30.8 U1.29
$2N4095: length 3
  Top Layer w0.5: LED2.2 v1(44,52.92)
  Bottom Layer w0.5: v1(44,52.92) 44,51.1 43.94,51.05
$2N4199: length 2.9
  Top Layer w0.5: LED1.2 v1(48,52.92)
  Bottom Layer w0.5: R8.2 48.01,52.91 v1(48,52.92)
$2N4701: length 5
  Bottom Layer w0.254: R15.2 R11.1 30.28,25.85 30.28,27.79 30.78,28.29 U4.6
$2N4706: length 3.8
  Bottom Layer w0.35: U4.2 34.48,27.79
  Bottom Layer w0.7: L2.2 34.51,27.76 C23.1
$2N4806: length 3.5
  Bottom Layer w0.254: U4.4 31.79,27.29 32.72,26.36 34.48,26.36 C23.2
$2N5028: length 2.9
  Top Layer w0.5: LED3.2 v1(46,52.92)
  Bottom Layer w0.5: v1(46,52.92) 46,51.07 45.97,51.05
$3N51879: length 2.6
  Top Layer w0.35: R23.1 19.05,52.07 18.68,52.44 U13.6
$3N51883: length 3.2
  Top Layer w0.35: R24.1 21.64,54.56 20.82,53.74 U13.3
$3N52120: length 3.9
  Top Layer w0.254: U14.6 19.42,43.29 19.81,43.69 19.81,45.42 R25.1
$3N52122: length 1.6
  Top Layer w0.254: U14.3 21.32,46.1 R26.1
$3N56615: length 19.4
  Top Layer w0.7: R27.1 19.91,58.11 19.2,58.83 v1(15.13,58.83) v1(14.3,58.83)
  Bottom Layer w0.7: v1(15.13,58.83) 14.07,58.83 13.78,58.53 U11.40
$3N56672: length 20.9
  Bottom Layer w0.4: U11.37 3.67,50.91 4.72,51.97 4.72,56.08 6.18,57.54 v1(18.19,57.54)
$3N57148: length 5
  Top Layer w0.35: R30.1 5.57,28.04 3.91,28.04 3.25,28.7 LED4.1
$3N57149: length 6
  Top Layer w0.35: R29.1 2.06,27.56 1.55,28.07 LED4.2
$3N57150: length 7.1
  Top Layer w0.35: R31.1 6.74,31.46 6.15,32.06 2.77,32.06 1.55,30.84 LED4.3
$3N57159: length 2.5
  Top Layer w0.35: R30.2 9.14,29.21 9.58,28.77 U12.2
$3N57160: length 2.6
  Top Layer w0.35: R29.2 8.86,27.56 9.43,28.12 10.61,28.12
$3N57175: length 3.2
  Top Layer w0.35: 10.61,29.42 10.57,29.46 10.57,29.96 9.66,30.86 R31.2

## Copper pours and planes (outline as drawn; the poured copper is in the pictures)
GND on Top Layer: 29.51,8.08 33.99,8.08 33.99,5.94 29.51,5.94
GND on Top Layer: 33.66,8.89 36.32,8.89 36.32,8.13 33.66,8.13
GND on Top Layer: -6.45,63.86 53.34,63.86 53.34,-4.78 -6.45,-4.78
GND on Top Layer: 29.57,16.2 33.93,16.2 33.93,14.33 29.57,14.33
GND on Top Layer: 33.66,13.97 36.32,13.97 36.32,13.21 33.66,13.21
GND on Bottom Layer: -7.16,65.73 56.29,65.73 56.29,-8.38 -7.16,-8.38
GND on Inner1: 0.26,59.74 49.74,59.74 49.74,0.26 0.26,0.26
GND on Inner2: 0.26,59.74 49.74,59.74 49.74,0.26 0.26,0.26
PWR on Top Layer: 40,31.24 44.32,31.24 44.32,22.61 40,22.61
PWR on Top Layer: 30.48,35.69 42.42,35.69 42.42,31.88 30.48,31.88
PWR on Bottom Layer: 36.95,25 44.32,25 44.32,22.61 36.95,22.61
PWR on Bottom Layer: 40,31.24 44.32,31.24 44.32,22.61 40,22.61
PWR_AB on Top Layer: 40.59,22.05 44.33,22.05 44.33,16.38 40.59,16.38
PWR_AB on Top Layer: 34.57,7.08 38.38,7.08 38.38,5.09 34.57,5.09
PWR_AB on Bottom Layer: 36.29,10.74 38.96,10.74 38.96,9.46 36.29,9.46
PWR_AB on Bottom Layer: 40.59,22.05 44.33,22.05 44.33,16.38 40.59,16.38
PWR_AB on Bottom Layer: 34.57,7.08 38.38,7.08 38.38,5.09 34.57,5.09
PWR_CD on Top Layer: 34.54,16.99 38.41,16.99 38.41,15.07 34.54,15.07
PWR_CD on Bottom Layer: 36.29,12.76 39.19,12.76 39.19,11.26 36.29,11.26
PWR_CD on Bottom Layer: 36.95,22.05 40.13,22.05 40.13,19.45 36.95,19.45
PWR_CD on Bottom Layer: 34.54,16 38.48,16 38.48,14.5 34.54,14.5
$2N397 on Top Layer: 29.67,32.26 31.85,32.26 31.85,30.01 29.67,30.01
$2N397 on Top Layer: 30.34,30.69 31.87,30.69 31.87,23.11 30.34,23.11
$2N415 on Top Layer: 26.31,30.66 27.84,30.66 27.84,23.09 26.31,23.09
$2N415 on Top Layer: 26.34,32.27 28.22,32.27 28.22,30.01 26.34,30.01
$2N8816 on Top Layer: 19.61,34.95 27.4,34.95 27.4,31.39 19.61,31.39

Small or netless copper shapes (teardrops, artwork), in the pictures only: 57 on Top Layer, 20 on Inner1, 20 on Inner2

## Text on the board
Bottom Silkscreen Layer: DESIGN: MILOS RASIC / DATE: OCT 2025 / VERSION: 1.0 | HEATSINK AREA | SDA0 | SCL0 | VIN | GND | VIN RANGE / 5V-36V | GO VROOM! | RASPBERRY / PI PICO 2
Top Silkscreen Layer: 3V3 | 5V | 12V | I2C0 | I2C1 | GND | SCL | SDA | DEBUG | SPI | DUAL MOTOR DRIVER | VIN | MOTOR2 | MOTOR1
